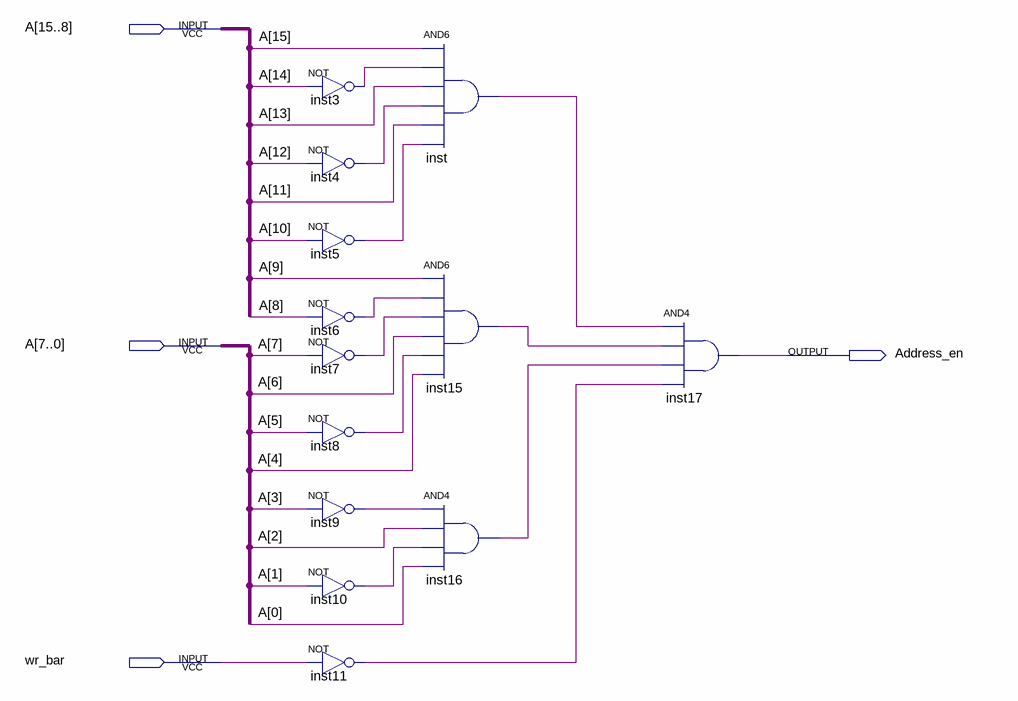
[diagram p0: schematic sheet]
// Quartus schematic address_decoder.bdf as structural Verilog: 13 symbols, 4 pins
module address_decoder (
  input  [15:0] A,
  input  wr_bar,
  output Address_en
);

  wire inst3_out, inst4_out, inst5_out, inst6_out, inst7_out, inst8_out, inst9_out, inst10_out, inst11_out,
       inst15_out, inst16_out, inst_out;

  not inst3 (inst3_out, A[14]);
  not inst4 (inst4_out, A[12]);
  not inst5 (inst5_out, A[10]);
  not inst6 (inst6_out, A[8]);
  not inst7 (inst7_out, A[7]);
  not inst8 (inst8_out, A[5]);
  not inst9 (inst9_out, A[3]);
  not inst10 (inst10_out, A[1]);
  not inst11 (inst11_out, wr_bar);
  and inst (inst_out, A[15], inst3_out, A[13], inst4_out, A[11], inst5_out);
  and inst15 (inst15_out, A[9], inst6_out, inst7_out, A[6], inst8_out, A[4]);
  and inst16 (inst16_out, inst9_out, A[2], inst10_out, A[0]);
  and inst17 (Address_en, inst_out, inst15_out, inst16_out, inst11_out);
endmodule
